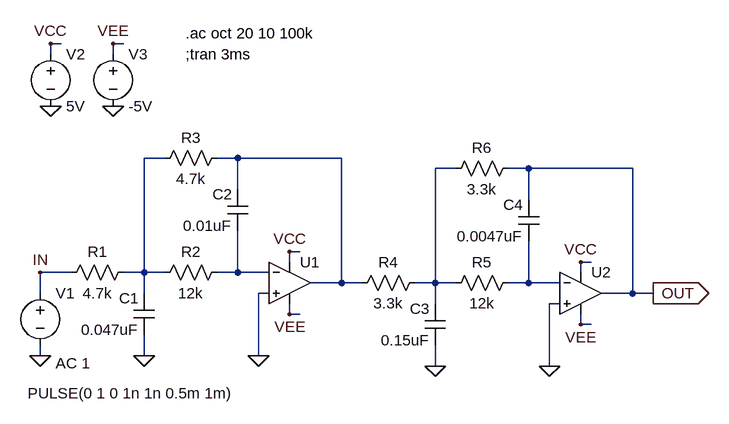
[diagram p0: schematic 4thButterWorthLPF_MFB.asc]
4thButterWorthLPF_MFB.asc, the LTspice schematic file:
Version 4
SHEET 1 880 680
WIRE -336 -176 -352 -176
WIRE -240 -176 -256 -176
WIRE -352 -160 -352 -176
WIRE -256 -160 -256 -176
WIRE -176 0 -208 0
WIRE -64 0 -96 0
WIRE 96 0 -64 0
WIRE 272 16 240 16
WIRE 384 16 352 16
WIRE 544 16 384 16
WIRE -64 48 -64 0
WIRE 384 64 384 16
WIRE 32 144 16 144
WIRE 16 160 16 144
WIRE 480 160 464 160
WIRE -320 176 -368 176
WIRE -208 176 -208 0
WIRE -208 176 -240 176
WIRE -176 176 -208 176
WIRE -64 176 -64 112
WIRE -64 176 -96 176
WIRE -16 176 -64 176
WIRE 464 176 464 160
WIRE 96 192 96 0
WIRE 96 192 48 192
WIRE 128 192 96 192
WIRE 240 192 240 16
WIRE 240 192 208 192
WIRE 272 192 240 192
WIRE 384 192 384 128
WIRE 384 192 352 192
WIRE 432 192 384 192
WIRE -368 208 -368 176
WIRE -208 208 -208 176
WIRE -16 208 -32 208
WIRE 544 208 544 16
WIRE 544 208 496 208
WIRE 576 208 544 208
WIRE 240 224 240 192
WIRE 432 224 416 224
WIRE 16 240 16 224
WIRE 32 240 16 240
WIRE 464 256 464 240
WIRE 480 256 464 256
WIRE -368 304 -368 288
WIRE -208 304 -208 272
WIRE -32 304 -32 208
WIRE 240 320 240 288
WIRE 416 320 416 224
FLAG 16 144 VCC
FLAG 16 240 VEE
FLAG -368 304 0
FLAG -352 -80 0
FLAG -256 -80 0
FLAG -352 -176 VCC
FLAG -256 -176 VEE
FLAG 576 208 OUT
IOPIN 576 208 Out
FLAG -208 304 0
FLAG -32 304 0
FLAG 464 160 VCC
FLAG 464 256 VEE
FLAG 240 320 0
FLAG 416 320 0
FLAG -368 176 IN
SYMBOL Opamps\\UniversalOpamp2 16 192 R0
SYMATTR InstName U1
SYMBOL res -224 160 R90
WINDOW 0 0 56 VBottom 2
WINDOW 3 32 56 VTop 2
SYMATTR InstName R1
SYMATTR Value 4.7k
SYMBOL res -80 160 R90
WINDOW 0 0 56 VBottom 2
WINDOW 3 32 56 VTop 2
SYMATTR InstName R2
SYMATTR Value 12k
SYMBOL cap -192 272 R180
WINDOW 0 24 56 Left 2
WINDOW 3 24 8 Left 2
SYMATTR InstName C1
SYMATTR Value 0.047uF
SYMBOL voltage -368 192 R0
WINDOW 123 24 124 Left 2
WINDOW 39 0 0 Left 2
WINDOW 3 -19 170 Left 2
SYMATTR Value2 AC 1
SYMATTR Value PULSE(0 1 0 1n 1n 0.5m 1m)
SYMATTR InstName V1
SYMBOL voltage -352 -176 R0
WINDOW 123 0 0 Left 2
WINDOW 39 0 0 Left 2
SYMATTR InstName V2
SYMATTR Value 5V
SYMBOL voltage -256 -176 R0
WINDOW 123 0 0 Left 2
WINDOW 39 0 0 Left 2
SYMATTR InstName V3
SYMATTR Value -5V
SYMBOL cap -48 112 R180
WINDOW 0 24 56 Left 2
WINDOW 3 24 8 Left 2
SYMATTR InstName C2
SYMATTR Value 0.01uF
SYMBOL res -80 -16 R90
WINDOW 0 0 56 VBottom 2
WINDOW 3 32 56 VTop 2
SYMATTR InstName R3
SYMATTR Value 4.7k
SYMBOL Opamps\\UniversalOpamp2 464 208 R0
SYMATTR InstName U2
SYMBOL res 224 176 R90
WINDOW 0 0 56 VBottom 2
WINDOW 3 32 56 VTop 2
SYMATTR InstName R4
SYMATTR Value 3.3k
SYMBOL res 368 176 R90
WINDOW 0 0 56 VBottom 2
WINDOW 3 32 56 VTop 2
SYMATTR InstName R5
SYMATTR Value 12k
SYMBOL cap 256 288 R180
WINDOW 0 24 56 Left 2
WINDOW 3 24 8 Left 2
SYMATTR InstName C3
SYMATTR Value 0.15uF
SYMBOL cap 400 128 R180
WINDOW 0 24 56 Left 2
WINDOW 3 24 8 Left 2
SYMATTR InstName C4
SYMATTR Value 0.0047uF
SYMBOL res 368 0 R90
WINDOW 0 0 56 VBottom 2
WINDOW 3 32 56 VTop 2
SYMATTR InstName R6
SYMATTR Value 3.3k
TEXT -144 -192 Left 2 !.ac oct 20 10 100k
TEXT -144 -160 Left 2 !;tran 3ms

The netlist it stands for:
* 4thButterWorthLPF_MFB.asc
XU1 0 N004 VCC VEE N002 level.2 Avol=1Meg GBW=10Meg Slew=10Meg ilimit=25m rail=0 Vos=0 phimargin=45 en=0 enk=0 in=0 ink=0 Rin=500Meg  ; pins IN+ IN- V+ V- OUT
R1 N001 IN 4.7k
R2 N004 N001 12k
C1 0 N001 0.047uF
V1 IN 0 PULSE(0 1 0 1n 1n 0.5m 1m) AC 1
V2 VCC 0 5V
V3 VEE 0 -5V
C2 N004 N002 0.01uF
R3 N002 N001 4.7k
XU2 0 N005 VCC VEE OUT level.2 Avol=1Meg GBW=10Meg Slew=10Meg ilimit=25m rail=0 Vos=0 phimargin=45 en=0 enk=0 in=0 ink=0 Rin=500Meg  ; pins IN+ IN- V+ V- OUT
R4 N003 N002 3.3k
R5 N005 N003 12k
C3 0 N003 0.15uF
C4 N005 OUT 0.0047uF
R6 OUT N003 3.3k
.ac oct 20 10 100k
;tran 3ms
.lib UniversalOpamps2.sub
.backanno
.end